# Altium schematic sheet mcu1_secondary.SchDoc: foxBMS BMS-Master
size A3; DocumentNumber: 11; SheetNumber: 11; SheetTotal: 24; Author: Fraunhofer IISB foxBMS Team; REL-DATE: 2017-05-16; VERSION: 1.0.2; SheetDescription: MCU1 (Secondary)
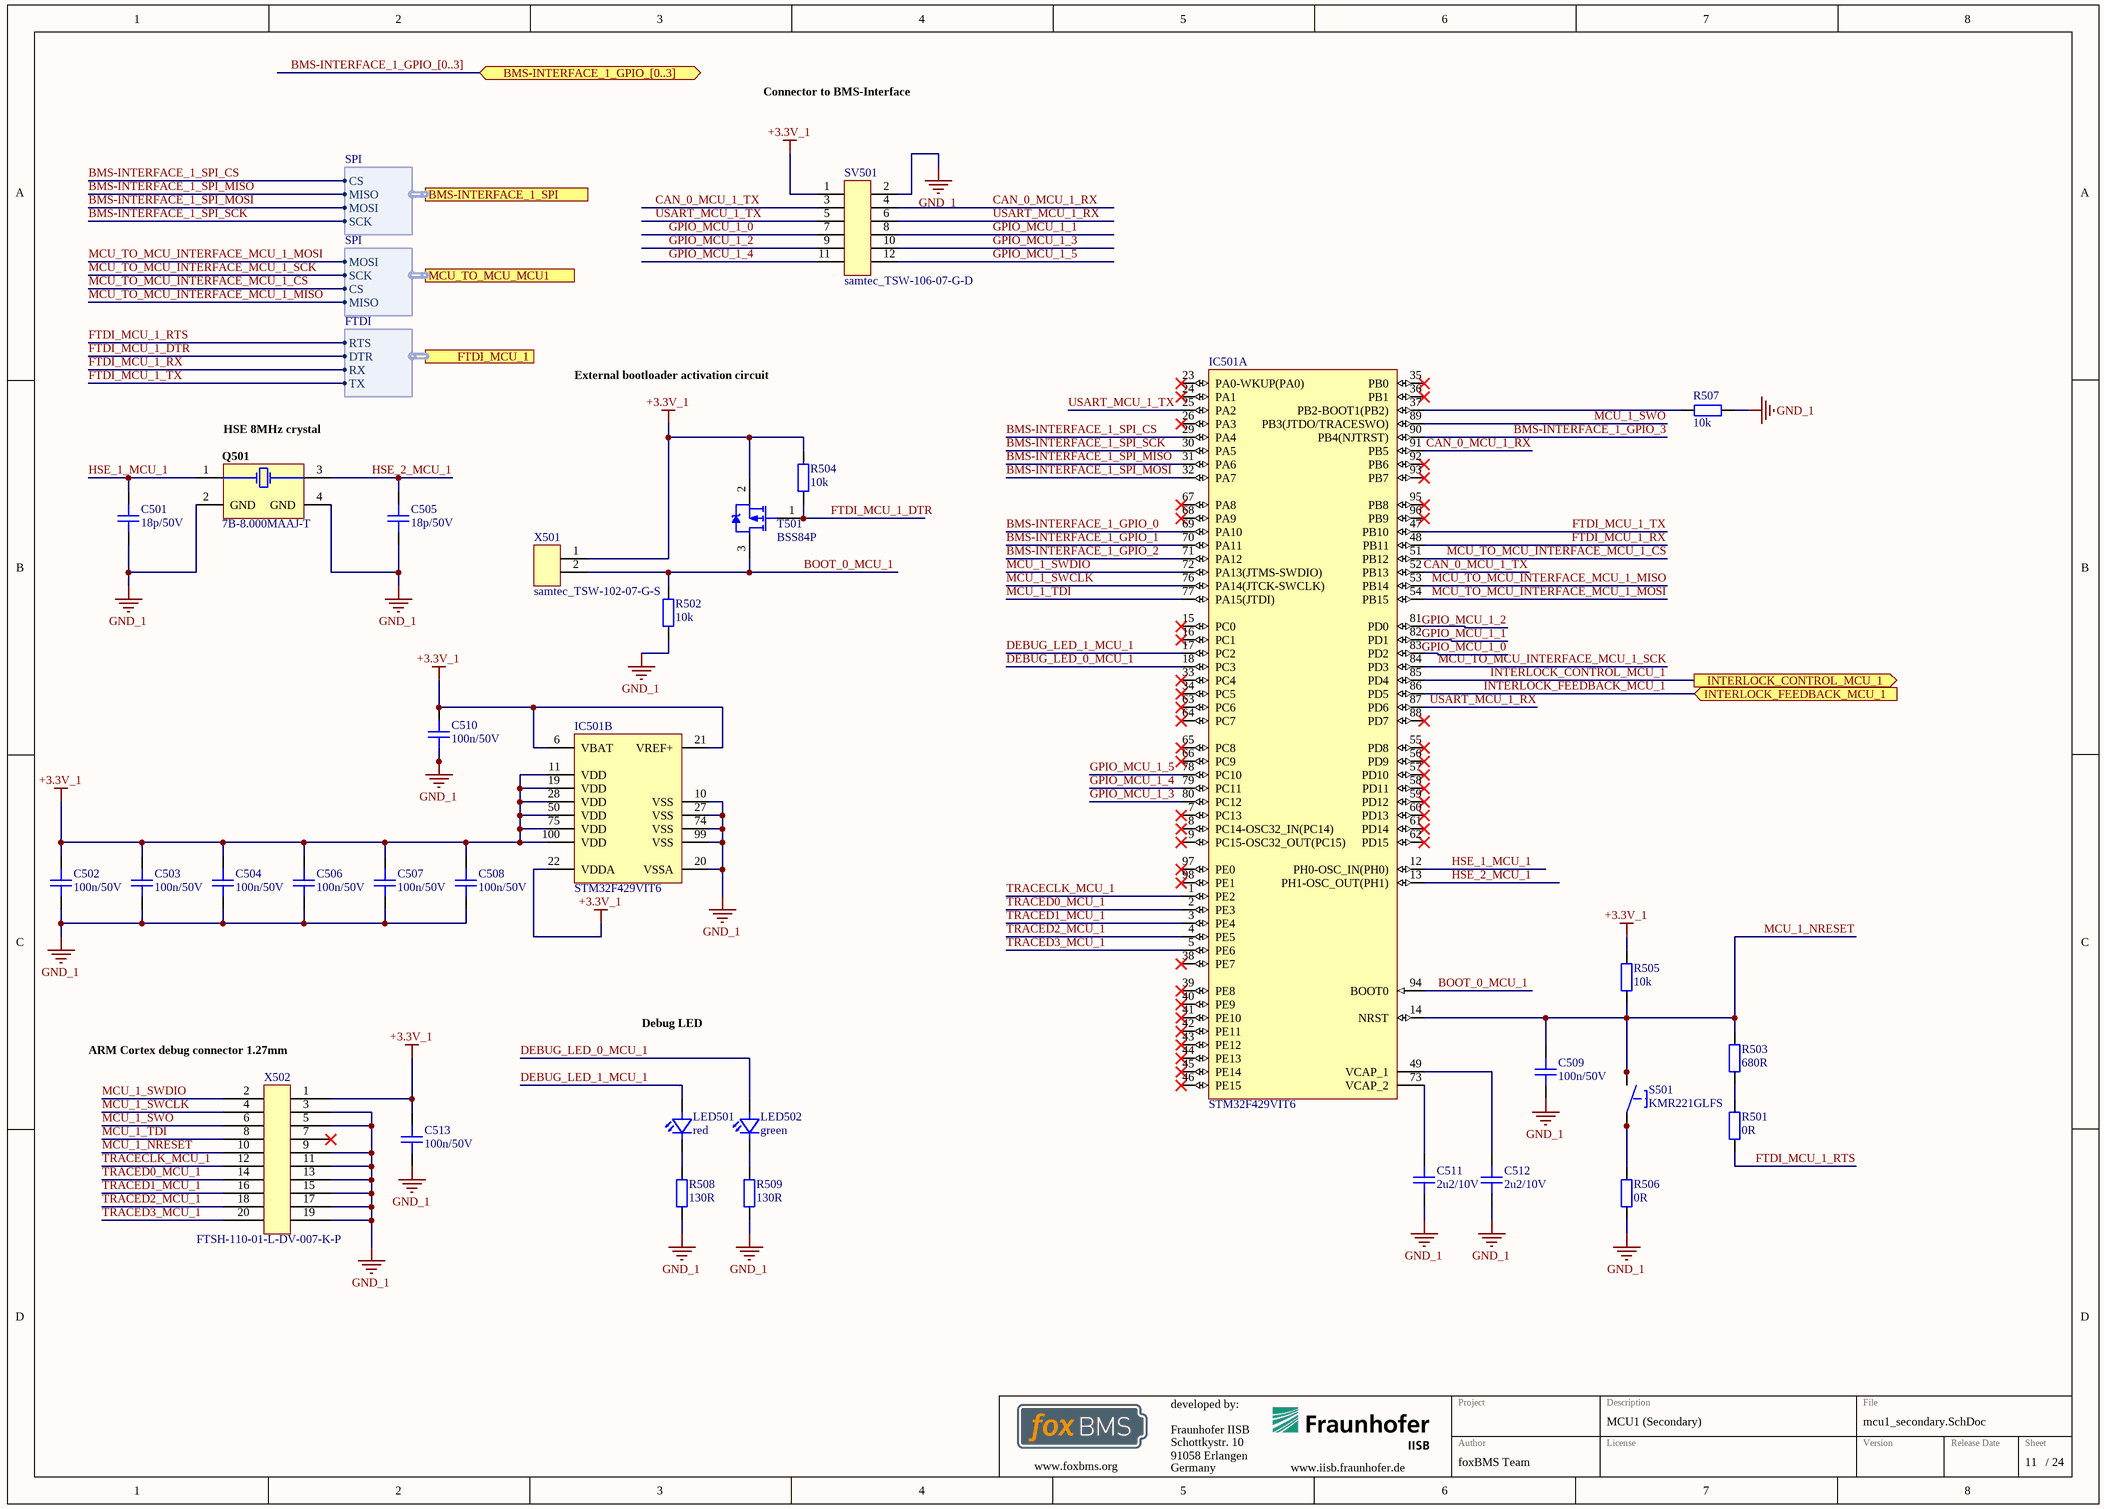
[diagram p0: mcu1_secondary.SchDoc]

## Parts
C501  18p/50V  [CAPC1608X08N]
C502  100n/50V  [CAPC1608X08N]
C503  100n/50V  [CAPC1608X08N]
C504  100n/50V  [CAPC1608X08N]
C505  18p/50V  [CAPC1608X08N]
C506  100n/50V  [CAPC1608X08N]
C507  100n/50V  [CAPC1608X08N]
C508  100n/50V  [CAPC1608X08N]
C509  100n/50V  [CAPC1608X08N]
C510  100n/50V  [CAPC1608X08N]
C511  2u2/10V  [CAPC1608X08N]
C512  2u2/10V  [CAPC1608X08N]
C513  100n/50V  [CAPC1608X08N]
IC501  STM32F429VIT6  [STM-LQFP100_N]  (parts A,B of 2)
LED501  red  [LEDC1608X07N]
LED502  green  [LEDC1608X07N]
Q501  7B-8.000MAAJ-T  [TXC-7B-4_V]
R501  0R  [RESC1608X05N]
R502  10k  [RESC1608X05N]
R503  680R  [RESC1608X05N]
R504  10k  [RESC1608X05N]
R505  10k  [RESC1608X05N]
R506  0R  [RESC1608X05N]
R507  10k  [RESC1608X05N]
R508  130R  [RESC1608X05N]
R509  130R  [RESC1608X05N]
S501  KMR221GLFS  [KMR2_Series]
SV501  samtec_TSW-106-07-G-D  [Pinheader_2.54_2x6]
T501  BSS84P  [INF-PG-SOT23_N]
X501  samtec_TSW-102-07-G-S  [Pinheader_2.54_2]
X502  FTSH-110-01-L-DV-007-K-P  [CORTEX_DEBUG_20_PIN]

## Ports
BMS-INTERFACE_1_GPIO_[0..3] (bidir), BMS-INTERFACE_1_SPI (harness SPI), FTDI_MCU_1 (harness FTDI), INTERLOCK_CONTROL_MCU_1 (out), INTERLOCK_FEEDBACK_MCU_1 (in), MCU_TO_MCU_MCU1 (harness SPI)

## Harnesses
SPI: CS, MISO, MOSI, SCK
FTDI: RTS, DTR, RX, TX

## Nets
+3.3V_1: C502.1 C503.1 C504.1 C506.1 C507.1 C508.1 C510.1 C513.1 IC501.6(VBAT) IC501.11(VDD) IC501.19(VDD) IC501.21(VREF+) IC501.22(VDDA) IC501.28(VDD) IC501.50(VDD) IC501.75(VDD) IC501.100(VDD) R504.2 R505.2 SV501.1 T501.2(SOURCE) X501.1 X502.1
GND_1: C501.1 C502.2 C503.2 C504.2 C505.2 C506.2 C507.2 C508.2 C509.2 C510.2 C511.2 C512.2 C513.2 IC501.10(VSS) IC501.20(VSSA) IC501.27(VSS) IC501.74(VSS) IC501.99(VSS) Q501.2(GND) Q501.4(GND) R502.1 R506.1 R507.1 R508.1 R509.1 SV501.2 X502.3 X502.5 X502.9 X502.11 X502.13 X502.15 X502.17 X502.19
BMS-INTERFACE_1_GPIO_0: IC501.69(PA10)
BMS-INTERFACE_1_GPIO_1: IC501.70(PA11)
BMS-INTERFACE_1_GPIO_2: IC501.71(PA12)
BMS-INTERFACE_1_GPIO_3: IC501.90(PB4(NJTRST))
BMS-INTERFACE_1_SPI_CS: IC501.29(PA4) ; port BMS-INTERFACE_1_SPI.CS
BMS-INTERFACE_1_SPI_MISO: IC501.31(PA6) ; port BMS-INTERFACE_1_SPI.MISO
BMS-INTERFACE_1_SPI_MOSI: IC501.32(PA7) ; port BMS-INTERFACE_1_SPI.MOSI
BMS-INTERFACE_1_SPI_SCK: IC501.30(PA5) ; port BMS-INTERFACE_1_SPI.SCK
BOOT_0_MCU_1: IC501.94(BOOT0) R502.2 T501.3(DRAIN) X501.2
CAN_0_MCU_1_RX: IC501.91(PB5) SV501.4
CAN_0_MCU_1_TX: IC501.52(PB13) SV501.3
DEBUG_LED_0_MCU_1: IC501.18(PC3) LED502.2(A)
DEBUG_LED_1_MCU_1: IC501.17(PC2) LED501.2(A)
FTDI_MCU_1_DTR: R504.1 T501.1(GATE) ; port FTDI_MCU_1.DTR
FTDI_MCU_1_RTS: R501.2 ; port FTDI_MCU_1.RTS
FTDI_MCU_1_RX: IC501.48(PB11) ; port FTDI_MCU_1.RX
FTDI_MCU_1_TX: IC501.47(PB10) ; port FTDI_MCU_1.TX
GPIO_MCU_1_0: IC501.83(PD2) SV501.7
GPIO_MCU_1_1: IC501.82(PD1) SV501.8
GPIO_MCU_1_2: IC501.81(PD0) SV501.9
GPIO_MCU_1_3: IC501.80(PC12) SV501.10
GPIO_MCU_1_4: IC501.79(PC11) SV501.11
GPIO_MCU_1_5: IC501.78(PC10) SV501.12
HSE_1_MCU_1: C501.2 IC501.12(PH0-OSC_IN(PH0)) Q501.1(X1)
HSE_2_MCU_1: C505.1 IC501.13(PH1-OSC_OUT(PH1)) Q501.3(X2)
INTERLOCK_CONTROL_MCU_1: IC501.85(PD4) ; port INTERLOCK_CONTROL_MCU_1
INTERLOCK_FEEDBACK_MCU_1: IC501.86(PD5) ; port INTERLOCK_FEEDBACK_MCU_1
MCU_1_NRESET: C509.1 IC501.14(NRST) R503.1 R505.1 S501.3 S501.4 X502.10
MCU_1_SWCLK: IC501.76(PA14(JTCK-SWCLK)) X502.4
MCU_1_SWDIO: IC501.72(PA13(JTMS-SWDIO)) X502.2
MCU_1_SWO: IC501.89(PB3(JTDO/TRACESWO)) X502.6
MCU_1_TDI: IC501.77(PA15(JTDI)) X502.8
MCU_TO_MCU_INTERFACE_MCU_1_CS: IC501.51(PB12) ; port MCU_TO_MCU_MCU1.CS
MCU_TO_MCU_INTERFACE_MCU_1_MISO: IC501.53(PB14) ; port MCU_TO_MCU_MCU1.MISO
MCU_TO_MCU_INTERFACE_MCU_1_MOSI: IC501.54(PB15) ; port MCU_TO_MCU_MCU1.MOSI
MCU_TO_MCU_INTERFACE_MCU_1_SCK: IC501.84(PD3) ; port MCU_TO_MCU_MCU1.SCK
TRACECLK_MCU_1: IC501.1(PE2) X502.12
TRACED0_MCU_1: IC501.2(PE3) X502.14
TRACED1_MCU_1: IC501.3(PE4) X502.16
TRACED2_MCU_1: IC501.4(PE5) X502.18
TRACED3_MCU_1: IC501.5(PE6) X502.20
USART_MCU_1_RX: IC501.87(PD6) SV501.6
USART_MCU_1_TX: IC501.25(PA2) SV501.5
NetC511_1: C511.1 IC501.73(VCAP_2)
NetC512_1: C512.1 IC501.49(VCAP_1)
NetIC501_37: IC501.37(PB2-BOOT1(PB2)) R507.2
NetLED501_1: LED501.1(C) R508.2
NetLED502_1: LED502.1(C) R509.2
NetR501_1: R501.1 R503.2
NetR506_2: R506.2 S501.1 S501.2

Not connected (* = marked no-connect by the designer): IC501 7(PC13)* 8(PC14-OSC32_IN(PC14))* 9(PC15-OSC32_OUT(PC15))* 15(PC0)* 16(PC1)* 23(PA0-WKUP(PA0))* 24(PA1)* 26(PA3)* 33(PC4)* 34(PC5)* 35(PB0)* 36(PB1)* 38(PE7)* 39(PE8)* 40(PE9)* 41(PE10)* 42(PE11)* 43(PE12)* 44(PE13)* 45(PE14)* 46(PE15)* 55(PD8)* 56(PD9)* 57(PD10)* 58(PD11)* 59(PD12)* 60(PD13)* 61(PD14)* 62(PD15)* 63(PC6)* 64(PC7)* 65(PC8)* 66(PC9)* 67(PA8)* 68(PA9)* 88(PD7)* 92(PB6)* 93(PB7)* 95(PB8)* 96(PB9)* 97(PE0)* 98(PE1)*; X502 7*

## Buses and harness runs
bus BMS-INTERFACE_1_GPIO_[0..3] = port BMS-INTERFACE_1_GPIO_[0..3]

## Notes on the sheet
- Connector to BMS-Interface
- External bootloader activation circuit
- (near Q501) HSE 8MHz crystal
- (near X502) ARM Cortex debug connector 1.27mm
- Debug LED
- Fraunhofer IISB
- Schottkystr. 10
- developed by:
- 91058 Erlangen
- Germany
- Author
- Project
- License
- Description
- File
- Version
- Release Date
- Sheet
- www.foxbms.org
- www.iisb.fraunhofer.de
- foxBMS Team
- /

## Library data of the parts
C501 C505 = gen_C_ceramic_18p_50V_C0G_0603: MLCC; Capacitance: 18p; Rated Voltage: 50V; Dielectric: C0G; Case EIA: 0603; Case Metric: 1608; Automotive Qualified: False; Part Number: gen_C_ceramic_18p_50V_C0G_0603; Supplier 1: Farnell; Supplier Part Number 1: 2070403
C502-C504 C506-C510 C513 = gen_C_ceramic_100n_50V_X7R_0603: MLCC; Capacitance: 100n; Rated Voltage: 50V; Dielectric: X7R; Case EIA: 0603; Case Metric: 1608; PnP Package: C_0603_10; PnP Value: 100n/50V/X7R; PnP equipped: x; Automotive Qualified: False; Part Number: gen_C_ceramic_100n_50V_X7R_0603; Supplier 1: Farnell; Supplier Part Number 1: 2525267; Supplier 2: Digikey; Supplier Part Number 2: 490-6049-1-ND
C511 C512 = gen_C_ceramic_2u2_10V_X5R_0603: MLCC; Capacitance: 2u2; Rated Voltage: 10V; Dielectric: X5R; Case EIA: 0603; Case Metric: 1608; AVT Set: x; Automotive Qualified: False; Part Number: gen_C_ceramic_2u2_10V_X5R_0603; Supplier 1: Farnell; Supplier Part Number 1: 2320817
IC501 = CMP-0243-00030-2: ARM Cortex-M4 32-bit MCU+FPU, 225 DMIPS, 2048 kB Flash, 256 kB Internal RAM, 82 I/Os, 100-pin LQFP, -40 to 85 degC, Tray; Manufacturer: STMicroelectronics; FLASH Size (Prog) (kB): 2048; Supply Voltage(Vcc) min (V): 1.8; Operating Frequency(F) (Processor speed) (MHz): 180; Supply Voltage(Vcc) max (V): 3.6; D/A Converter: 2x12-bit; Internal RAM Size (kB): 256; I/Os (High Current): 82; Mounting Technology: Surface Mount; ComponentLink3URL: http://www.st.com/st-web-ui/static/active/en/resource/technical/document/data_brief/DM00071938.pdf; ComponentLink2URL: http://www.st.com/st-web-ui/static/active/en/resource/technical/document/data_brief/DM00053488.pdf; ComponentLink3Description: Package Specification; Packing: Tray; PackageDescription: 100-Pin Low Profile Quad Flat Package, 14 x 14 mm Body, 0.5 mm Pitch; PartNumber: STM32F429VIT6; ComponentLink2Description: Datasheet; ComponentLink1Description: Manufacturer URL; ComponentLink1URL: http://www.st.com/web/en/home.html; DatasheetVersion: Rev. 2; Core: ARM Cortex-M4; PackageReference: LQFP100; PackageVersion: Rev. 1, 06/2013
LED501 = gen_LED_0603_red: LED; Breakdown Voltage: 5V; Continuous Forward Current: 20mA; Forward Voltage @ 20mA: 2V; Automotive Qualified: False; Part Number: gen_LED_0603_red; Color: red; PnP Package: LED_0603; Supplier 1: Farnell; Supplier Part Number 1: 2099221
LED502 = gen_LED_0603_green: LED; Breakdown Voltage: 5V; Continuous Forward Current: 20mA; Forward Voltage @ 20mA: 2.2V; Automotive Qualified: False; Part Number: gen_LED_0603_green; Color: green; PnP Package: LED_0603; Supplier 1: Farnell; Supplier Part Number 1: 2099223
Q501 = CMP-1774-00004-1: SMD Seam Sealing Crystal, 8 MHz, +/- 30 ppm, 18 pF, -10 to 70 degC, 4-Pin SMD, RoHS, Tape and Reel; Power Rating: 100 mW; Case\Package: 0603; Voltage Rating: 50 V; Tolerance: 1%; Resistance: 150 Ohm; Package Quantity: 5000; Case Code (Metric): 1608; Packaging: Tape and Reel; Length: 1.6 mm; RoHSCompliant: true; REACH SVHC: No SVHC; Mount: Surface Mount; Case Code (Imperial): 0603; Pins: 2; Width: 0.8 mm; PackageDescription: 4-Pin Surface Mount Device, Body 5 x 3.2 mm, Pitch 3.7 mm; ComponentLink1Description: Datasheet; DatasheetVersion: Jul-15; ComponentLink1URL: http://www.txccorp.com/download/products/quartz_crystals/2015TXC_7B_19.pdf; PackageReference: 7B-4; Height: 0.45 mm; Max Operating Temperature: 155 degC; Min Operating Temperature: -55 degC; Voltage Rating (DC): 50 V
R501 R506 = gen_R_0R_0603: SMD Resistor 0R 0603; Power: 0.1W; Case EIA: 0603; Case Metric: 1608; PnP Package: R_0603; Maximum Working Voltage: 75V; Automotive Qualified: False; Part Number: gen_R_0R_0603; Operating Temperature: -55°C - +155°C; Resistance: 0R; Series: Jumper; PnP Value: 0R; Supplier 1: Farnell; Supplier Part Number 1: 2073345
R502 R504 R505 R507 = gen_R_10k_0603: SMD Resistor 10k 0603; Tolerance: 1%; Power: 0.1W; Case EIA: 0603; Case Metric: 1608; Maximum Working Voltage: 75V; PnP Package: R_0603; Automotive Qualified: False; Part Number: gen_R_10k_0603; Operating Temperature: -55°C - +155°C; Resistance: 10k; Series: E24, E96; PnP Value: 10k; Supplier 1: Farnell; Supplier Part Number 1: 2073349
R503 = gen_R_680R_0603: SMD Resistor 680R 0603; Tolerance: 1%; Power: 0.1W; Case EIA: 0603; Case Metric: 1608; Maximum Working Voltage: 75V; PnP Package: R_0603; Automotive Qualified: False; Part Number: gen_R_680R_0603; Operating Temperature: -55°C - +155°C; Resistance: 680R; Series: E24; PnP Value: 680R; Supplier 1: Farnell; Supplier Part Number 1: 2797303
R508 R509 = gen_R_130R_0603: SMD Resistor 130R 0603; Tolerance: 1%; Power: 0.1W; Case EIA: 0603; Case Metric: 1608; Maximum Working Voltage: 75V; PnP Package: R_0603; Automotive Qualified: False; Part Number: gen_R_130R_0603; Operating Temperature: -55°C - +155°C; Resistance: 130R; Series: E24, E96; PnP Value: 130R; Supplier 1: Farnell; Supplier Part Number 1: 2379959
S501 = KMR221GLFS: Microminiature Tactile Switch; Manufacturer: CK Components; Automotive Qualified: False; Part Number: KMR221GLFS; Operating Temperature: -40°C - +85°C; ComponentLink1Description: Datasheet; ComponentLink1URL: http://www.farnell.com/datasheets/1685525.pdf; Supplier 1: Farnell; Supplier Part Number 1: 1201424; Supplier 2: Digikey; Supplier Part Number 2: 401-1426-1-ND; Supplier 3: Mouser; Supplier Part Number 3: 611-KMR211G-LFS
SV501 = samtec_TSW-106-07-G-D: Board-To-Board Connector, Vertical, 2.54 mm, 12 Contacts, Header, TSW Series, Through Hole, 2 Rows; Manufacturer: Samtec; Circuits: 12; Rated Voltage: 500V AC mated with SSW; Automotive Qualified: False; Part Number: samtec_TSW-106-07-G-D; Part Name: TSW-106-07-G-D; Operating Temperature: -55°C - +125°C; ComponentLink1Description: Datasheet; ComponentLink1URL: http://www.farnell.com/datasheets/1992055.pdf?_ga=2.196729640.569325269.1503285096-1413671594.1503025027; Supplier 1: Farnell; Supplier Part Number 1: 2025252
T501 = CMP-1099-00028-1: P-Channel SIPMOS Small-Signal-Transistor, -60 V VDS, -0.17 A ID, -55 to 150 degC, PG-SOT23, Reel, Green; Manufacturer: Infineon; VGS(th) (max): -2Â V; VGS(th) (min): -1Â V; VDS (max): -60Â V; Rth: 350Â K/W; Pto t (max): 0.36Â W; ID (max): -0.17Â A; IDpuls (max): -0.68Â A; RDS (on) (max) (@4.5V): 12,000Â mOhm; QG: 1Â nC; Green: TRUE; RDS (on) (max): 8,000Â mOhm; ComponentLink3URL: http://www.infineon.com/dgdl/SOT23-Package_Overview.pdf?folderId=db3a30431936bc4b0119532290053c66&fileId=db3a30431936bc4b0119533468123c85; ComponentLink3Description: Package Specification; Packing: Reel; PartNumber: BSS84P; ComponentLink2Description: Datasheet; Mounting Technology: Surface Mount; ComponentLink2URL: http://www.infineon.com/dgdl/BSS84P_Rev2.7%5B1%5D.pdf?folderId=db3a304314dca38901154a72e3951a65&fileId=db3a304330f68606013118ac7a9b4549; PackageReference: PG-SOT23; ComponentLink1URL: http://www.infineon.com/; PackageVersion: Apr-08; ComponentLink1Description: Manufacturer URL; PackageDescription: 3-Pin Small Outline Transistor Package, 2.9 x 1.3 mm Body, 0.95 mm Pitch; Halogen-free: TRUE; DatasheetVersion: Rev. 2.7
X501 = samtec_TSW-102-07-G-S: Board-To-Board Connector, Vertical, 2.54 mm, 2 Contacts, Header, TSW Series, Through Hole, 1 Row; Manufacturer: Samtec; Circuits: 2; Automotive Qualified: False; Part Number: samtec_TSW-102-07-G-S; Part Name: TSW-102-07-G-S; Operating Temperature: -55°C - +125°C; ComponentLink1Description: Datasheet; ComponentLink1URL: http://www.farnell.com/datasheets/1796313.pdf; Supplier 1: Farnell; Supplier Part Number 1: 2505044
X502 = samtec_FTSH-110-01-L-DV-007-K-P: Board-To-Board Connector, ARM Cortex Debug Header 20 Pin; Manufacturer: Samtec; Circuits: 20; Automotive Qualified: False; Part Number: samtec_FTSH-110-01-L-DV-007-K-P; Part Name: FTSH-110-01-L-DV-007-K-P; Operating Temperature: -55°C - +125°C; Supplier 1: Digikey; Supplier Part Number 1: SAM11268-ND; Supplier 2: Avnet; Supplier Part Number 2: FTSH-110-01-L-DV-007-K-P